# Altium schematic sheet LEDS-SMD.SchDoc
size A4
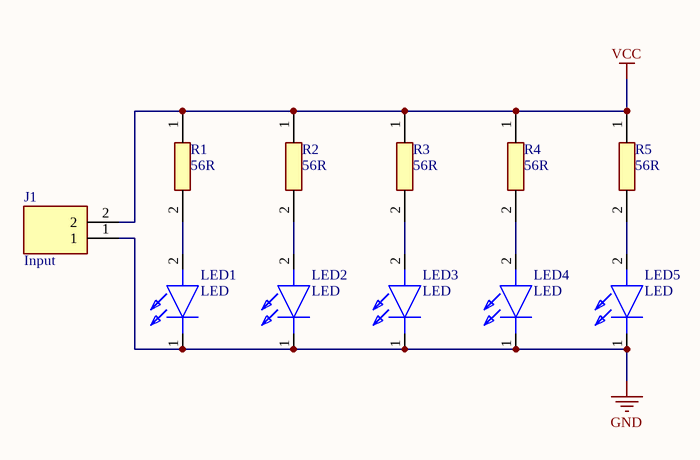
[diagram p0: LEDS-SMD.SchDoc]

## Parts
J1  Input  [1760510000]
LED1  LED  [LEDC2012X90N]
LED2  LED  [LEDC2012X90N]
LED3  LED  [LEDC2012X90N]
LED4  LED  [LEDC2012X90N]
LED5  LED  [LEDC2012X90N]
R1  56R  [RESC2012X50N]
R2  56R  [RESC2012X50N]
R3  56R  [RESC2012X50N]
R4  56R  [RESC2012X50N]
R5  56R  [RESC2012X50N]

## Nets
GND: J1.1 LED1.1(K) LED2.1(K) LED3.1(K) LED4.1(K) LED5.1(K)
VCC: J1.2 R1.1 R2.1 R3.1 R4.1 R5.1
NetLED1_2: LED1.2(A) R1.2
NetLED2_2: LED2.2(A) R2.2
NetLED3_2: LED3.2(A) R3.2
NetLED4_2: LED4.2(A) R4.2
NetLED5_2: LED5.2(A) R5.2

## Library data of the parts
J1 = 1760510000: Connector; Manufacturer_Name: Weidmuller; Datasheet Link: http://catalog.weidmueller.com/createDatasheetForMobile.do?ordernumber=1760510000&scope1=1&scope2=1&localeId=en; Height: 10mm; Manufacturer_Part_Number: 1760510000; Mouser Part Number: 470-1760510000; Mouser Price/Stock: https://www.mouser.co.uk/ProductDetail/Weidmuller/1760510000?qs=BTG2th8YmhTa8qcglSF3eg%3D%3D
LED1-LED5 = HSML-C170-T0000: Manufacturer_Name: Avago Technologies; Datasheet Link: https://docs.broadcom.com/docs/HSML-C170-T0000-DS100; Height: 0.9mm; Manufacturer_Part_Number: HSML-C170-T0000; Mouser Part Number: 630-HSML-C170-T0000; Mouser Price/Stock: https://www.mouser.co.uk/ProductDetail/Broadcom-Avago/HSML-C170-T0000?qs=tMOYG%252Bw4%252BLxmTmD%252BKOjV4Q%3D%3D
R1-R5 = CRCW080556R0FKEA: Resistor; Manufacturer_Name: Vishay; Datasheet Link: http://www.vishay.com/docs/20035/dcrcwe3.pdf; Height: 0.5mm; Manufacturer_Part_Number: CRCW080556R0FKEA; Mouser Part Number: 71-CRCW080556R0FKEA; Mouser Price/Stock: https://www.mouser.co.uk/ProductDetail/Vishay-Dale/CRCW080556R0FKEA?qs=8UjxRNpjuULXqZI3Oden4Q%3D%3D; Arrow Part Number: CRCW080556R0FKEA; Arrow Price/Stock: https://www.arrow.com/en/products/crcw080556r0fkea/vishay?region=nac